# Altium project Flash_Card_Reader.PrjPcb
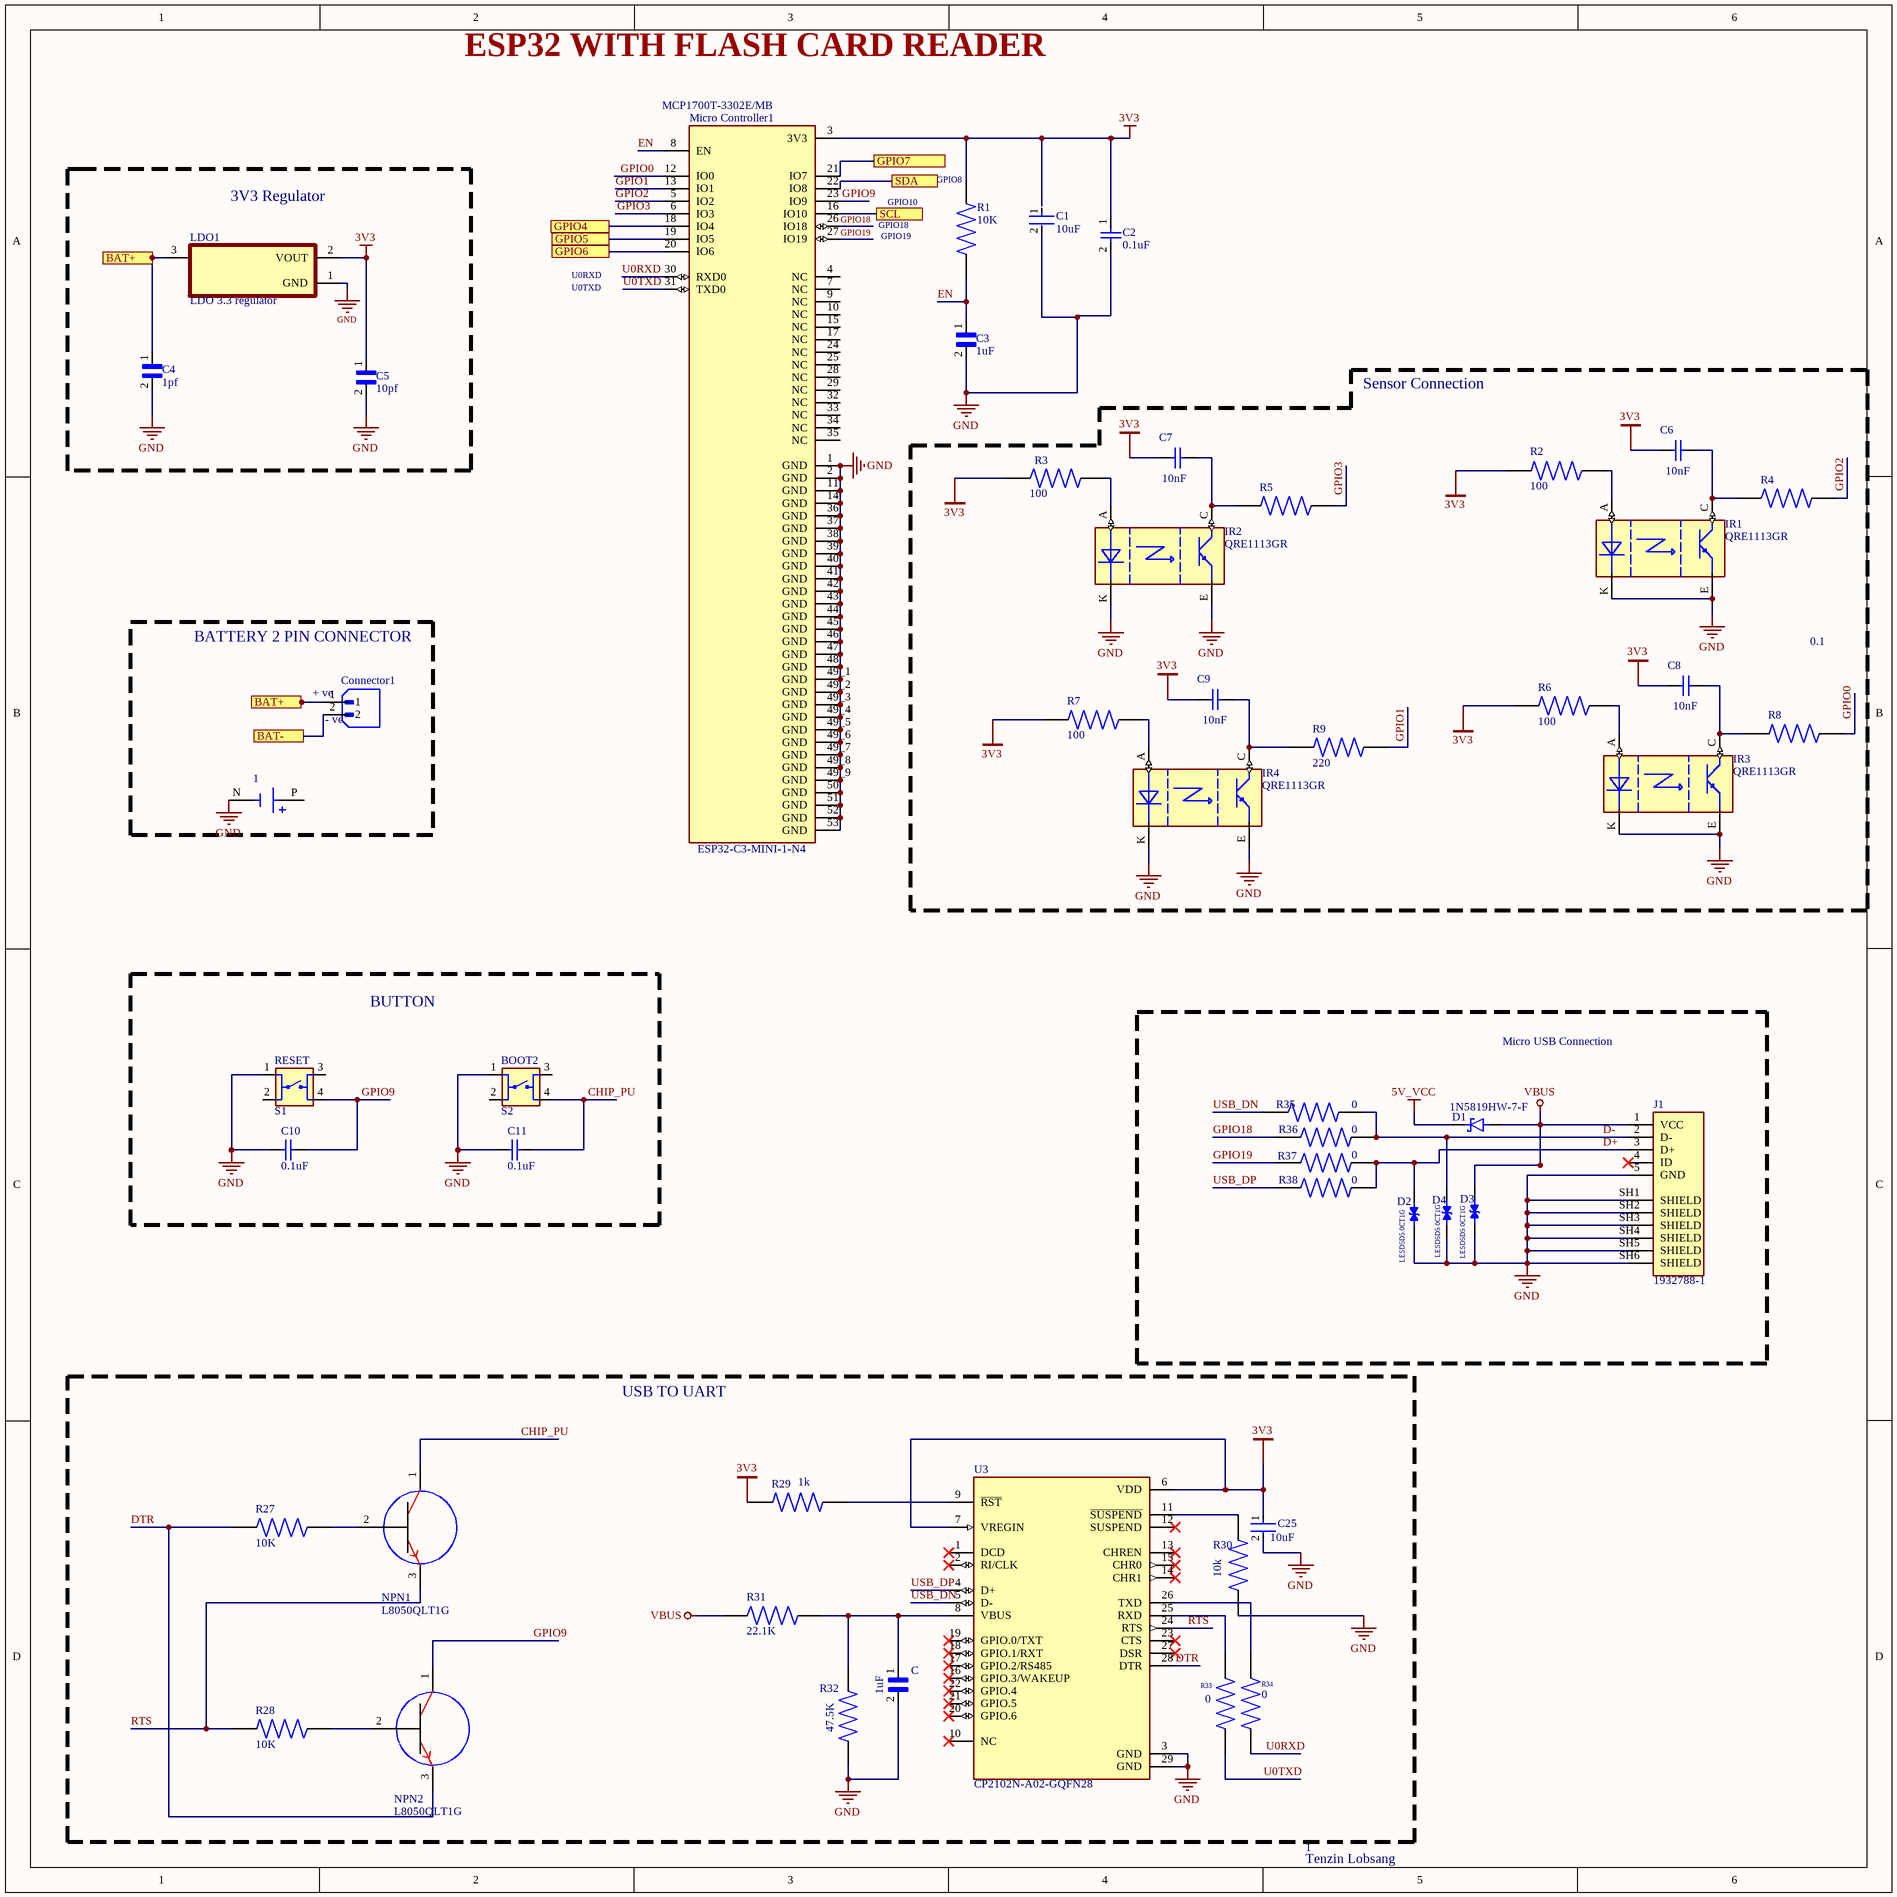
[diagram p0: ESP32_FLASH_CARD_READER.SchDoc]
2 sheets, 98 parts. Net scope: flat (ports and power ports of the same name join across sheets).
Board file: ESP32_FLAS_CARD_READER.PcbDoc
Sheets:
  ESP32_FLASH_CARD_READER.SchDoc
  ESP32_USBC_CHARGER.SchDoc

## Sheet ESP32_FLASH_CARD_READER.SchDoc
size 381 x 381 mm; SheetNumber: 1; SheetTotal: 2

### Parts
1  (no value)  [BAT_1043]
BOOT2  S2  [SW_4-1437565-2]
C  1uF  [CAPC1608X90N]
C1  10uF  [CAPC2012X88N]
C2  0.1uF  [CAPC1608X90X35NL10T15]
C3  1uF  [CAPC1608X90N]
C4  1pf  [CAPC2012X88N]
C5  10pf  [CAPC2012X88N]
C6  10nF  [WCAP-CSGP_0805_L2W1.25H1.25]
C7  10nF  [WCAP-CSGP_0805_L2W1.25H1.25]
C8  10nF  [WCAP-CSGP_0805_L2W1.25H1.25]
C9  10nF  [WCAP-CSGP_0805_L2W1.25H1.25]
C10  0.1uF  [CAPC1608X90X35NL10T15]
C11  0.1uF  [CAPC1608X90X35NL10T15]
C25  10uF  [CAPC2012X88N]
Connector1  B2B-XH-A  [JST_B2B-XH-A]  (value not drawn)
D1  1N5819HW-7-F  [SOD3715X145N]
D2  LESD5D5.0CT1G  [TVS_LESD5D5.0CT1G]
D3  LESD5D5.0CT1G  [TVS_LESD5D5.0CT1G]
D4  LESD5D5.0CT1G  [TVS_LESD5D5.0CT1G]
IR1  QRE1113GR  [4LEADSMD]
IR2  QRE1113GR  [4LEADSMD]
IR3  QRE1113GR  [4LEADSMD]
IR4  QRE1113GR  [4LEADSMD]
J1  1932788-1  [TE_1932788-1]
LDO1  LDO 3.3 regulator  [SOT95P237X112-3N]
Micro_Controller1  ESP32-C3-MINI-1-N4  Supplier Part Number 1: MCP1700T-3302E/MB  [XCVR_ESP32-C3-MINI-1-N4]
NPN1  L8050QLT1G  [SOT-23]
NPN2  L8050QLT1G  [SOT-23]
R1  10K  [RESC1005X40N]
R2  100  [RESC6432X75N]
R3  100  [RESC6432X75N]
R4  220  [RESC1005X35N]  (value not drawn)
R5  220  [RESC1005X35N]  (value not drawn)
R6  100  [RESC6432X75N]
R7  100  [RESC6432X75N]
R8  220  [RESC1005X35N]  (value not drawn)
R9  220  [RESC1005X35N]
R27  10K  [RESC1005X40N]
R28  10K  [RESC1005X40N]
R29  1k  [RES_ERJU06F1001V]
R30  10k  [RESC1005X40N]
R31  22.1K  [RES_ERJS02F2212X]
R32  47.5K  [RES_ERJU06F4752V]
R33  0  [RESC1608X55N]
R34  0  [RESC1608X55N]
R35  0  [RESC1608X55N]
R36  0  [RESC1608X55N]
R37  0  [RESC1608X55N]
R38  0  [RESC1608X55N]
RESET  S1  [SW_4-1437565-2]
U3  CP2102N-A02-GQFN28  [QFN50P500X500X80-29N]

### Blocks framed on the sheet
3V3 Regulator: C4 C5 LDO1
Sensor Connection: C6-C9 IR1-IR4 R2-R9
BATTERY 2 PIN CONNECTOR: 1 Connector1
BUTTON: BOOT2 C10 C11 RESET
Micro USB Connection: D1-D4 J1 R35-R38
USB TO UART: C C25 NPN1 NPN2 R27-R34 U3

### Ports
BAT+, BAT-, GPIO4, GPIO5, GPIO6, GPIO7, SCL, SDA

### Nets
3V3: C2.1 C5.1 C6.1 C7.1 C8.1 C9.1 C25.1 LDO1.2(VOUT) Micro_Controller1.3(3V3) R1.2 R2.1 R3.1 R6.1 R7.1 R29.1 U3.6(VDD) U3.7(VREGIN)
5V_VCC: D1.C(K)
GND: 1.N(NEG) BOOT2.1 C.2 C1.2 C2.2 C3.2 C4.2 C5.2 C10.1 C11.1 C25.2 D2.1 D3.2 D4.1 IR1.E IR1.K IR2.E IR2.K IR3.E IR3.K IR4.E IR4.K J1.5(GND) J1.SH1(SHIELD) J1.SH2(SHIELD) J1.SH3(SHIELD) J1.SH4(SHIELD) J1.SH5(SHIELD) J1.SH6(SHIELD) LDO1.1(GND) Micro_Controller1.1(GND) Micro_Controller1.2(GND) Micro_Controller1.11(GND) Micro_Controller1.14(GND) Micro_Controller1.36(GND) Micro_Controller1.37(GND) Micro_Controller1.38(GND) Micro_Controller1.39(GND) Micro_Controller1.40(GND) Micro_Controller1.41(GND) Micro_Controller1.42(GND) Micro_Controller1.43(GND) Micro_Controller1.44(GND) Micro_Controller1.45(GND) Micro_Controller1.46(GND) Micro_Controller1.47(GND) Micro_Controller1.48(GND) Micro_Controller1.49_1(GND) Micro_Controller1.49_2(GND) Micro_Controller1.49_3(GND) Micro_Controller1.49_4(GND) Micro_Controller1.49_5(GND) Micro_Controller1.49_6(GND) Micro_Controller1.49_7(GND) Micro_Controller1.49_8(GND) Micro_Controller1.49_9(GND) Micro_Controller1.50(GND) Micro_Controller1.51(GND) Micro_Controller1.52(GND) Micro_Controller1.53(GND) R30.1 R32.1 RESET.1 U3.3(GND) U3.29(GND)
VBUS: D1.A D3.1 J1.1(VCC) R31.1
CHIP_PU: BOOT2.4 C11.2 NPN1.1
D+: D2.2 J1.3(D+) R37.1 R38.1
D-: D4.2 J1.2(D-) R35.1 R36.1
DTR: R27.1 U3.28(DTR)
EN: C3.1 Micro_Controller1.8(EN) R1.1
GPIO0: Micro_Controller1.12(IO0) R8.2
GPIO1: Micro_Controller1.13(IO1) R9.2
GPIO2: Micro_Controller1.5(IO2) R4.2
GPIO3: Micro_Controller1.6(IO3) R5.2
GPIO9: C10.2 Micro_Controller1.23(IO9) NPN2.1 RESET.4
GPIO18: Micro_Controller1.26(IO18) R36.2
GPIO19: Micro_Controller1.27(IO19) R37.2
RTS: R28.1 U3.24(RTS)
U0RXD: Micro_Controller1.30(RXD0) R34.1
U0TXD: Micro_Controller1.31(TXD0) R33.1
USB_DN: R35.2 U3.5(D-)
USB_DP: R38.2 U3.4(D+)
NetC4_1: C4.1 Connector1.1 LDO1.3(VIN) ; port BAT+
NetC6_2: C6.2 IR1.C R4.1
NetC7_2: C7.2 IR2.C R5.1
NetC8_2: C8.2 IR3.C R8.1
NetC9_2: C9.2 IR4.C R9.1
NetC21_2: Connector1.2 ; port BAT-
NetC_1: C.1 R31.2 R32.2 U3.8(VBUS)
NetDAC1_4: Micro_Controller1.22(IO8) ; port SDA
NetDAC1_5: Micro_Controller1.16(IO10) ; port SCL
NetIR1_A: IR1.A R2.2
NetIR2_A: IR2.A R3.2
NetIR3_A: IR3.A R6.2
NetIR4_A: IR4.A R7.2
NetMicro_Controller1_18: Micro_Controller1.18(IO4) ; port GPIO4
NetMicro_Controller1_19: Micro_Controller1.19(IO5) ; port GPIO5
NetMicro_Controller1_20: Micro_Controller1.20(IO6) ; port GPIO6
NetMicro_Controller1_21: Micro_Controller1.21(IO7) ; port GPIO7
NetNPN1_2: NPN1.2 R27.2
NetNPN2_2: NPN2.2 R28.2
NetR29_2: R29.2 U3.9(~{RST})
NetR30_2: R30.2 U3.11(~{SUSPEND})
NetR33_2: R33.2 U3.25(RXD)
NetR34_2: R34.2 U3.26(TXD)

Not connected (* = marked no-connect by the designer): 1 P(POS); BOOT2 2 3; C1 1; J1 4(ID)*; Micro_Controller1 4(NC) 7(NC) 9(NC) 10(NC) 15(NC) 17(NC) 24(NC) 25(NC) 28(NC) 29(NC) 32(NC) 33(NC) 34(NC) 35(NC); NPN1 3; NPN2 3; RESET 2 3; U3 1(DCD)* 2(RI/CLK)* 10(NC)* 12(SUSPEND)* 13(CHREN)* 14(CHR1)* 15(CHR0)* 16(GPIO.3/WAKEUP)* 17(GPIO.2/RS485)* 18(GPIO.1/RXT)* 19(GPIO.0/TXT)* 20(GPIO.6)* 21(GPIO.5)* 22(GPIO.4)* 23(CTS)* 27(DSR)*

### Notes on the sheet
- ESP32 WITH FLASH CARD READER
- GPIO10
- (near R1) GPIO8
- U0RXD
- GPIO18
- GPIO19
- U0TXD
- 0.1
- (near Connector1) + ve
- (near Connector1) - ve
- 1
- Tenzin Lobsang

### Library data of the parts
1 = 1043: Price: None; Availability: Unavailable; Value: *; MP: 1043; Package: None
BOOT2 RESET = 4-1437565-2: Switch Tactile OFF (ON) SPST Round Button Gull Wing 0.05A 12VDC 1.57N SMD T/R; Availability: Unavailable; Package: None; MP: 4-1437565-2; Value: *; Price: None
C C3 = CL10B105KO8NNNC: 1ÂµF Â±10% 16V Ceramic Capacitor X7R 0603 (1608 Metric); MF: Samsung Electro-Mechanics; Digi-Key_Part_Number: 1276-1019-1-ND; Arrow_Electronics-Purchase-URL: https://snapeda.com/shop?store=Arrow+Electronics&id=3597999; Package: 0603 Samsung; DigiKey-Purchase-URL: https://snapeda.com/shop?store=DigiKey&id=3597999; SnapEDA_Link: https://www.snapeda.com/parts/CL10B105KO8NNNC/Samsung%20Electro-Mechanics/view-part/3597999/?ref=snap; MP: CL10B105KO8NNNC; Value: *
  C3: BuyPart: https://www.snapeda.com/parts/CL10B105KO8NNNC/Samsung%20Electro-Mechanics/view-part/3597999/?ref=eda
C1 C25 = CMP-13271-004224-1: Cap Ceramic 10uF 25V X5R ±20% Pad SMD 0603 +85°C T/R; Width: 0.031inch; Voltage Rating: 25V; Length: 0.063inch; Case Code (Metric): 1608; Dielectric: X5R; Termination: Wraparound; Capacitance: 10uF; Lead Free: Lead Free; Mount: Surface Mount; Package Quantity: 1; Case Code (Imperial): 0603; Thickness: 0.035inch; Packaging: Tape and Reel; Contact Plating: Tin; Min Operating Temperature: -55°C; Tolerance: 20%; Max Operating Temperature: 85°C; Case/Package: 0603
C2 C10 C11 = CMP-2100-03643-1: Chip Capacitor, 0.1 uF, +/- 10%, 50 V, -55 to 125 degC, 0603 (1608 Metric), RoHS, Tape and Reel; Manufacturer: Murata; Dielectric Material: Ceramic; Voltage Rating: 50V; Capacitance: 100nF; Dielectric: X7R; Insulation Resistance: 10GR; Case Code (Metric): 1608; Lead Free: LeadFree; Depth: 0.8mm; Number of Pins: 2; Radiation Hardening: No; Case/Package: 0603; Manufacturer URL: http://www.murata.com/; Packaging: TapeandReel; Length: 1.6mm; Contact Plating: Tin; Datasheet URL: http://psearch.en.murata.com/capacitor/product/GRM188R71H104KA93%23.pdf; Tolerance: 10%; Case Code (Imperial): 0603; Min Operating Temperature: -55degC; RoHSCompliant: true; Voltage: 50V; Termination: SMD/SMT; Mount: SurfaceMount; Material: Ceramic; Package Quantity: 1; Height: 0.8mm; Thickness: 0.035inch; REACH SVHC: NoSVHC; Max Operating Temperature: 125degC; Width: 0.8mm; Package Reference: 0603; Voltage Rating (DC): 50V; Datasheet Version: 42675.0; Package Description: 2-Pin Surface Mount Device, Body 1.6 x 0.8 mm
C4 C5 = C0805C100K5RAC7800: Package: None; Price: None; Value: *; MP: C0805C100K5RAC7800; Availability: Unavailable
C6-C9 = 885012007009: WCAP-CSGP Multilayer Ceramic Chip Capacitor, General Purpose, size 0805, NP0, 10nF, 10V; Manufacturer: Wurth Elektronik; Case/Size Code: 0805; Capacitance Tolerance: +/-5%; Insulation Resistance: 10GΩ; Q Factor: 1000; Technical Reference: NP00805103J010DFCT10000; Manufacturer Part Number: 885012007009; Category: Multilayer Ceramic Chip Capacitors; Match Code: WCAP-CSGP; ComponentLink1Description: Website Link; ComponentLink1URL: https://www.we-online.com/redexpert/article/885012007009?ad; ComponentLink2Description: Datasheet Link; ComponentLink2URL: https://www.we-online.com/redexpert/spec/885012007009?ad; Mount: Surface Mount; Min Operating Temperature: -55°C; Max Operating Temperature: 125°C; Packaging: Tape and Reel; Length: 2mm; Width: 1.25mm; Height: 1.25mm; Capacitance: 10nF; Ceramic Type: NP0; Rated Voltage (DC): 10V
Connector1 = B2B-XH-A: MF: {'manufacturer': u'JST Sales America Inc.'}; Package: None; Price: None; Value: *; MP: B2B-XH-A; Availability: Unavailable
D1 = 1N5819HW-7-F: Diode Schottky 40 V 1A Surface Mount SOD-123; MF: Diodes Inc.; Value: *; SnapEDA_Link: https://www.snapeda.com/parts/1N5819HW-7-F/Diodes+Inc./view-part/?ref=snap; Purchase-URL: https://pricing.snapeda.com/search/part/1N5819HW-7-F/?ref=eda; Availability: In Stock; Price: None; Package: SOD-123 Fairchild Semiconductor; Check_prices: https://www.snapeda.com/parts/1N5819HW-7-F/Diodes+Inc./view-part/?ref=eda; MP: 1N5819HW-7-F
D2-D4 = LESD5D5.0CT1G: Transient Voltage Suppressors for ESD Protection; MF: Leshan Radio Co.; Check_prices: https://www.snapeda.com/parts/LESD5D5.0CT1G/Leshan+Radio+Co./view-part/?ref=eda; Value: *; Availability: Not in stock; Package: None; SnapEDA_Link: https://www.snapeda.com/parts/LESD5D5.0CT1G/Leshan+Radio+Co./view-part/?ref=snap; MP: LESD5D5.0CT1G; Price: None
IR1-IR4 = QRE1113GR: Optical Switches, Reflective, Phototransistor Output Reflective Sensor; MF: SparkFun; SnapEDA_Link: https://www.snapeda.com/parts/QRE1113/SparkFun/view-part/?ref=snap; Package: None; Value: *; MP: QRE1113; Check_prices: https://www.snapeda.com/parts/QRE1113/SparkFun/view-part/?ref=eda
LDO1 = MCP1700T-3002E/TT: 25V 10uF X5R ±20% 0603 Multilayer Ceramic Capacitors MLCC - SMD/SMT ROHS; Manufacturer: Samsung; Manufacturer Part Number: CL10A106MA8NRNC; MF: Microchip; SnapEDA_Link: https://www.snapeda.com/parts/MCP1700T-3002E/TT/Microchip/view-part/48518/?ref=snap; MP: MCP1700T-3002E/TT; Availability: Unavailable; Price: None; Value: *; Package: SOT-23 Microchip; Supplier 1: Avnet; RoHS: Yes; Category: Ceramic Capacitors; Stock 1: 9192000; Pricing 1: 4000=0.01575 (USD); Mount: Surface Mount; Case/Package: 0603; Case Code (Metric): 1608; Case Code (Imperial): 0603; Material: Ceramic; Min Operating Temperature: -55°C; Max Operating Temperature: 85°C; Packaging: Cut Tape; Capacitance: 10uF; Tolerance: 20%; Voltage Rating: 25V; Series: CL; Height: 900um; Lead Free: Lead Free; RoHS Compliant: Yes; ComponentLink1URL: https://datasheet.ciiva.com/25766/cl10a106ma8nrnc-25766562.pdf?src-supplier=Digikey; ComponentLink1Description: https://datasheet.ciiva.com/25766/cl10a106ma8nrnc-25766562.pdf?src-supplier=Digikey
Micro_Controller1 = ESP32-C3-MINI-1-N4: Pwr Sply Func, Voltage Regulator, LDO, SOT-89, PD 1.635W, VO 3.3V, Regline +/-0.75%/V; Manufacturer: Microchip; MF: Espressif Systems; Number of Outputs: 1; Min Input Voltage: 2.3V; Max Output Current: 250mA; Dropout Voltage: 178mV; Max Input Voltage: 6V; Input Bias Current: 1.6uA; Polarity: Positive; Quiescent Current: 4uA; Accuracy: 3%; Output Type: Fixed; Output Voltage Accuracy: 2%; SnapEDA_Link: https://www.snapeda.com/parts/ESP32-C3-MINI-1-N4/Espressif+Systems/view-part/?ref=snap; Package: SMD-53 Espressif Systems; Value: *; MP: ESP32-C3-MINI-1-N4; Check_prices: https://www.snapeda.com/parts/ESP32-C3-MINI-1-N4/Espressif+Systems/view-part/?ref=eda; Supplier 1: Arrow Electronics; Manufacturer Part Number: MCP1700T-3302E/MB; RoHS: Yes; Category: Voltage Regulators - Linear; Stock 1: 650; Pricing 1: 1=0.4806, 10=0.4731, 25=0.4655, 100=0.458, 250=0.4505, 500=0.4429 (USD); Mount: Surface Mount; Case/Package: SOT-89; Number of Pins: 3; Min Operating Temperature: -40°C; Max Operating Temperature: 125°C; Packaging: Tape and Reel; Output Voltage: 3.3V; Output Current: 250mA; Nominal Output Voltage: 3.3V; Package Quantity: 1000; Max Power Dissipation: 1.635W; Min Output Voltage: 3.3V; Power Dissipation: 1.635W; Max Supply Voltage: 6V; Min Supply Voltage: 2.3V; Max Output Voltage: 3.3V; Termination: SMD/SMT; Supply Current: 4uA; Number of Channels: 1; Length: 4.6mm; Width: 2.29mm; Height: 1.6mm; Radiation Hardening: No; Reach SVHC Compliant: No; Lead Free: Lead Free; RoHS Compliant: Yes
R1 R27 R28 R30 = CRG0402J10K/10: CRG0402 chip resistor,10K 5% 0.063W | TE Connectivity CRG0402J10K/10; Power_Rating: .063 W; Voltage_Rating: 50 V; SnapEDA_Link: https://www.snapeda.com/parts/CRG0402J10K/10/TE+Connectivity+Passive+Product/view-part/?ref=snap; Package: 0402; Resistance: 10K; Value: *; MF: TE Connectivity; MP: CRG0402J10K/10; EU_RoHS_Compliance: Compliant with Exemptions; Tolerance: 5%; Check_prices: https://www.snapeda.com/parts/CRG0402J10K/10/TE+Connectivity+Passive+Product/view-part/?ref=eda
R2 R3 R6 R7 = CRS2512-FX-1000ELF: CRS Series Anti-surge Resistor 2512 Case 100Ohms 2W +/-100ppm/degC | Bourns CRS2512-FX-1000ELF; SnapEDA_Link: https://www.snapeda.com/parts/CRS2512-FX-1000ELF/Bourns/view-part/?ref=snap; Package: 6432 Bourns; Value: *; MF: Bourns; MP: CRS2512-FX-1000ELF; Check_prices: https://www.snapeda.com/parts/CRS2512-FX-1000ELF/Bourns/view-part/?ref=eda
R4 R5 R8 R9 = CPF0402B220RE1: Resistencia de pelÃ­cula delgada de precisiÃ³n SMD, carcasa 0402, 220 ohmios +/-0,1 %, 063 W +/-25 ppm/C ¦ TE Connectivity CPF0402B220RE1; Power_Rating: .063 W; Voltage_Rating: 25 V; Tolerance: .1%; SnapEDA_Link: https://www.snapeda.com/parts/CPF0402B220RE1/TE+Connectivity/view-part/?ref=snap; Package: 0402; Resistance: 220; Value: *; MF: TE Connectivity; MP: CPF0402B220RE1; EU_RoHS_Compliance: Compliant; Check_prices: https://www.snapeda.com/parts/CPF0402B220RE1/TE+Connectivity/view-part/?ref=eda
R29 = ERJU06F1001V: Res Thick Film 0805 1K Ohm 1% 0.125W(1/8W) Â±100ppm/C Sulfur Resistant Pad SMD Automotive T/R; MF: Panasonic; Availability: No availability data; Value: *; Check_prices: https://www.snapeda.com/parts/ERJU06F1001V/Panasonic/view-part/5742057/?ref=eda; Package: 2012-2 Panasonic; SnapEDA_Link: https://www.snapeda.com/parts/ERJU06F1001V/Panasonic/view-part/5742057/?ref=snap; Price: None; MP: ERJU06F1001V
R31 = ERJS02F2212X: Price: None; MP: ERJS02F2212X; Package: None; Value: *; Availability: Unavailable
R32 = ERJU06F4752V: Package: None; Price: None; MP: ERJU06F4752V; Availability: Unavailable; Value: *
R33-R38 = MC0603SAF0000T5E: Package: None; Value: *; Price: None; MP: MC0603SAF0000T5E; Availability: Unavailable
U3 = CP2102N-A02-GQFN28: USB Bridge, USB to UART USB 2.0 UART Interface 28-QFN (5x5); MF: Silicon Labs; Value: *; Price: None; Package: WFQFN-28 Silicon Labs; Check_prices: https://www.snapeda.com/parts/CP2102N-A02-GQFN28/Silicon+Labs/view-part/?ref=eda; Availability: In Stock; SnapEDA_Link: https://www.snapeda.com/parts/CP2102N-A02-GQFN28/Silicon+Labs/view-part/?ref=snap; Purchase-URL: https://pricing.snapeda.com/search/part/CP2102N-A02-GQFN28/?ref=eda; MP: CP2102N-A02-GQFN28
J1 = 1932788-1: Package: None; Price: None; Value: *; MP: 1932788-1; Availability: Unavailable

## Sheet ESP32_USBC_CHARGER.SchDoc
size B; SheetNumber: 2; SheetTotal: 2
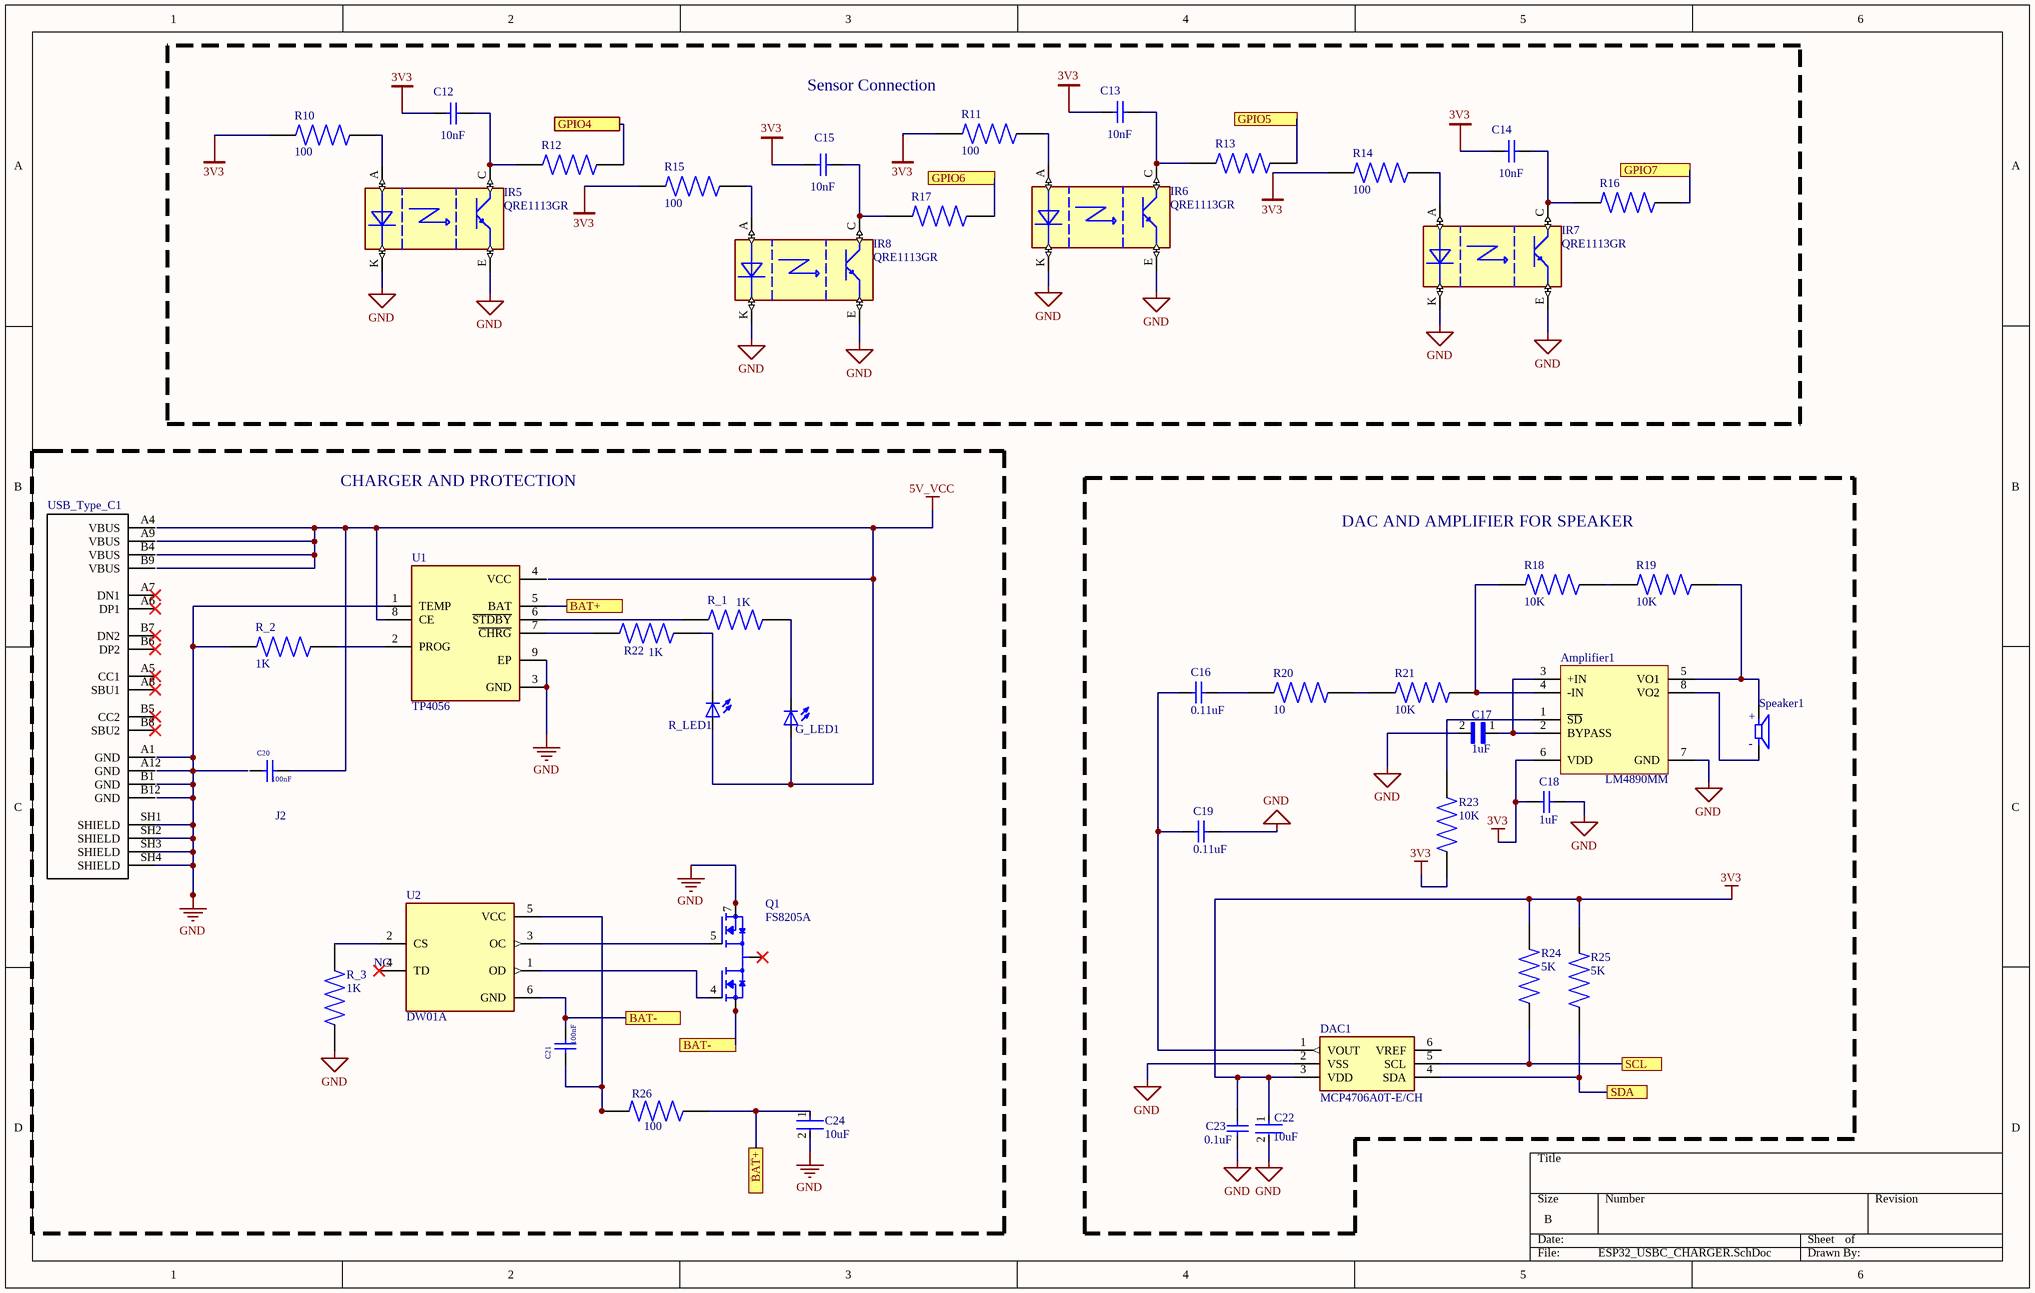
[diagram p1: ESP32_USBC_CHARGER.SchDoc]

### Parts
Amplifier1  LM4890MM  [DGK0008A_M]
C12  10nF  [WCAP-CSGP_0805_L2W1.25H1.25]
C13  10nF  [WCAP-CSGP_0805_L2W1.25H1.25]
C14  10nF  [WCAP-CSGP_0805_L2W1.25H1.25]
C15  10nF  [WCAP-CSGP_0805_L2W1.25H1.25]
C16  0.11uF  [CAPC1608X90X35NL10T15]
C17  1uF  [CAPC1608X90N]
C18  1uF  [CAPC1608X90X35NL10T15]
C19  0.11uF  [CAPC1608X90X35NL10T15]
C20  100nF  [WCAP-CSGP_0402_L1W0.5H0.5]
C21  100nF  [WCAP-CSGP_0402_L1W0.5H0.5]
C22  10uF  [CAPC2012X88N]
C23  0.1uF  [CAPC1608X90X35NL10T15]
C24  10uF  [CAPC2012X88N]
DAC1  MCP4706A0T-E/CH  [SOT95P270X145-6N]
G_LED1  TLLR4400  [LED3MM]  (value not drawn)
IR5  QRE1113GR  [4LEADSMD]
IR6  QRE1113GR  [4LEADSMD]
IR7  QRE1113GR  [4LEADSMD]
IR8  QRE1113GR  [4LEADSMD]
Q1  FS8205A  [SOP65P640X120-8N]
R10  100  [RESC6432X75N]
R11  100  [RESC6432X75N]
R12  220  [RESC1005X35N]  (value not drawn)
R13  220  [RESC1005X35N]  (value not drawn)
R14  100  [RESC6432X75N]
R15  100  [RESC6432X75N]
R16  220  [RESC1005X35N]  (value not drawn)
R17  220  [RESC1005X35N]  (value not drawn)
R18  10K  [RESC1005X40N]
R19  10K  [RESC1005X40N]
R20  10  [RESC1005X40N]
R21  10K  [RESC1005X40N]
R22  1K  [RES_ERJU06F1001V]
R23  10K  [RESC1005X40N]
R24  5K  [RESC3126X65N]
R25  5K  [RESC3126X65N]
R26  100  [RESC6432X75N]
R_1  1K  [RES_ERJU06F1001V]
R_2  1K  [RES_ERJU06F1001V]
R_3  1K  [RES_ERJU06F1001V]
R_LED1  TLLR4400  [LED3MM]  (value not drawn)
Speaker1  CVS-1508  [SPKR_CVS-1508]  (value not drawn)
U1  TP4056  [SOP127P600X175-9N]
U2  DW01A  [SOT95P280X145-6N]
USB_Type_C1  UJ20-C-H-G-SMT-TR  [*CUI_UJ20-C-H-G-SMT-TR_UJ20-C-H-G-SMT-TR(Primary)]  (value not drawn)

### Blocks framed on the sheet
Sensor Connection: C12-C15 IR5-IR8 R10-R17
CHARGER AND PROTECTION: C20 C21 C24 G_LED1 Q1 R22 R26 R_1-R_3 R_LED1 U1 U2 USB_Type_C1
DAC AND AMPLIFIER FOR SPEAKER: Amplifier1 C16-C19 C22 C23 DAC1 R18-R21 R23-R25 Speaker1

### Ports
BAT+, BAT-, GPIO4, GPIO5, GPIO6, GPIO7, SCL, SDA

### Nets
3V3: Amplifier1.6(VDD) C12.1 C13.1 C14.1 C15.1 C18.1 C22.1 C23.2 DAC1.3(VDD) R10.1 R11.1 R14.1 R15.1 R23.1 R24.2 R25.2
5V_VCC: C20.2 G_LED1.A R_LED1.A U1.8(CE)
GND: Amplifier1.7(GND) C17.2 C18.2 C19.2 C22.2 C23.1 C24.2 DAC1.2(VSS) IR5.E IR5.K IR6.E IR6.K IR7.E IR7.K IR8.E IR8.K Q1.6(S2) Q1.7(S2) R_2.1 R_3.1 U1.1(TEMP) U1.3(GND) U1.9(EP) USB_Type_C1.SH1(SHIELD) USB_Type_C1.SH2(SHIELD) USB_Type_C1.SH3(SHIELD) USB_Type_C1.SH4(SHIELD)
NetAmplifier1_1: Amplifier1.1(~{SD}) R23.2
NetAmplifier1_2: Amplifier1.2(BYPASS) Amplifier1.3(+IN) C17.1
NetAmplifier1_4: Amplifier1.4(-IN) R18.1 R21.2
NetAmplifier1_5: Amplifier1.5(VO1) R19.2 Speaker1.P
NetAmplifier1_8: Amplifier1.8(VO2) Speaker1.M
NetC4_1: C24.1 R26.2 U1.5(BAT) ; port BAT+
NetC12_2: C12.2 IR5.C R12.1
NetC13_2: C13.2 IR6.C R13.1
NetC14_2: C14.2 IR7.C R16.1
NetC15_2: C15.2 IR8.C R17.1
NetC16_1: C16.1 C19.1 DAC1.1(VOUT)
NetC16_2: C16.2 R20.1
NetC21_1: C21.1 R26.1 U2.5(VCC)
NetC21_2: C21.2 Q1.2(S1) Q1.3(S1) U2.6(GND) ; port BAT-
NetDAC1_4: DAC1.4(SDA) R25.1 ; port SDA
NetDAC1_5: DAC1.5(SCL) R24.1 ; port SCL
NetG_LED1_K: G_LED1.K(C) R_1.2
NetIR5_A: IR5.A R10.2
NetIR6_A: IR6.A R11.2
NetIR7_A: IR7.A R14.2
NetIR8_A: IR8.A R15.2
NetMicro_Controller1_18: R12.2 ; port GPIO4
NetMicro_Controller1_19: R13.2 ; port GPIO5
NetMicro_Controller1_20: R17.2 ; port GPIO6
NetMicro_Controller1_21: R16.2 ; port GPIO7
NetQ1_1: Q1.1(D12) Q1.8(D12)
NetQ1_4: Q1.4(G1) U2.1(OD)
NetQ1_5: Q1.5(G2) U2.3(OC)
NetR18_2: R18.2 R19.1
NetR20_2: R20.2 R21.1
NetR22_1: R22.1 U1.7(~{CHRG})
NetR22_2: R22.2 R_LED1.K(C)
NetR_1_1: R_1.1 U1.6(~{STDBY})
NetR_2_2: R_2.2 U1.2(PROG)
NetR_3_2: R_3.2 U2.2(CS)

Not connected (* = marked no-connect by the designer): C20 1; DAC1 6(VREF); U1 4(VCC); U2 4(TD)*; USB_Type_C1 A1(GND) A4(VBUS) A5(CC1)* A6(DP1)* A7(DN1)* A8(SBU1)* A9(VBUS) A12(GND) B1(GND) B4(VBUS) B5(CC2)* B6(DP2)* B7(DN2)* B8(SBU2)* B9(VBUS) B12(GND)

### Notes on the sheet
- (near C20) J2
- (near U2) NC
- (in symbol CVS-1508) +; -

### Library data of the parts
Amplifier1 = CMP-0057-00556-3: 1W Audio Power Amplifier, 8-pin Mini SOIC; Manufacturer: Texas Instruments; PackageTopMarking: ZXTT*G90; CompType: Audio IC; PowerWise: N; ComponentLink1URL: http://www.ti.com/general/docs/lit/getliterature.tsp?genericPartNumber=LM4890&fileType=pdf; ComponentLink1Description: Datasheet URL; RoHS: N; PackageReference: DGK0008A; PackageDescription: MINI SOIC, .118 x .118 x .034in, 8 Lead, .0256in Pitch; PinCount: 8; Code_JEDEC: MO-187-AA
C12-C15 = 885012007009: as C6 on sheet ESP32_FLASH_CARD_READER; Manufacturer Part Number: 885012007009; Category: Multilayer Ceramic Chip Capacitors; Match Code: WCAP-CSGP; ComponentLink1Description: Website Link; ComponentLink1URL: https://www.we-online.com/redexpert/article/885012007009?ad; ComponentLink2Description: Datasheet Link; ComponentLink2URL: https://www.we-online.com/redexpert/spec/885012007009?ad; Mount: Surface Mount; Min Operating Temperature: -55°C; Max Operating Temperature: 125°C; Packaging: Tape and Reel; Length: 2mm; Width: 1.25mm; Height: 1.25mm; Capacitance: 10nF; Ceramic Type: NP0; Rated Voltage (DC): 10V
C16 C18 C19 C23 = CMP-2100-03643-1: as C2 on sheet ESP32_FLASH_CARD_READER; Case Code (Metric): 1608; Lead Free: LeadFree; Depth: 0.8mm; Number of Pins: 2; Radiation Hardening: No; Case/Package: 0603; Manufacturer URL: http://www.murata.com/; Packaging: TapeandReel; Length: 1.6mm; Contact Plating: Tin; Datasheet URL: http://psearch.en.murata.com/capacitor/product/GRM188R71H104KA93%23.pdf; Tolerance: 10%; Case Code (Imperial): 0603; Min Operating Temperature: -55degC; RoHSCompliant: true; Voltage: 50V; Termination: SMD/SMT; Mount: SurfaceMount; Material: Ceramic; Package Quantity: 1; Height: 0.8mm; Thickness: 0.035inch; REACH SVHC: NoSVHC; Max Operating Temperature: 125degC; Width: 0.8mm; Package Reference: 0603; Voltage Rating (DC): 50V; Datasheet Version: 42675.0; Package Description: 2-Pin Surface Mount Device, Body 1.6 x 0.8 mm
C17 = CL10B105KO8NNNC: as C on sheet ESP32_FLASH_CARD_READER; Digi-Key_Part_Number: 1276-1019-1-ND; Arrow_Electronics-Purchase-URL: https://snapeda.com/shop?store=Arrow+Electronics&id=3597999; Package: 0603 Samsung; DigiKey-Purchase-URL: https://snapeda.com/shop?store=DigiKey&id=3597999; SnapEDA_Link: https://www.snapeda.com/parts/CL10B105KO8NNNC/Samsung%20Electro-Mechanics/view-part/3597999/?ref=snap; MP: CL10B105KO8NNNC; Value: *
C20 C21 = 885012105001: WCAP-CSGP Multilayer Ceramic Chip Capacitor, General Purpose, size 0402, X5R, 100nF, 6.3V; Manufacturer: Wurth Elektronik; Case/Size Code: 0402; Capacitance Tolerance: +/-20%; Dissipation Factor: 10%; Insulation Resistance: 1GΩ; Technical Reference: X5R0402104M6R3DFCT10000; Manufacturer Part Number: 885012105001; Category: Multilayer Ceramic Chip Capacitors; Match Code: WCAP-CSGP; ComponentLink1Description: Website Link; ComponentLink1URL: https://www.we-online.com/redexpert/article/885012105001?ad; ComponentLink2Description: Datasheet Link; ComponentLink2URL: https://www.we-online.com/redexpert/spec/885012105001?ad; Mount: Surface Mount; Min Operating Temperature: -55°C; Max Operating Temperature: 85°C; Packaging: Tape and Reel; Length: 1mm; Width: 0.5mm; Height: 0.5mm; Capacitance: 100nF; Ceramic Type: X5R; Rated Voltage (DC): 6.3V
C22 C24 = CMP-13271-004224-1: as C1 on sheet ESP32_FLASH_CARD_READER; Width: 0.031inch; Voltage Rating: 25V; Length: 0.063inch; Case Code (Metric): 1608; Dielectric: X5R; Termination: Wraparound; Capacitance: 10uF; Lead Free: Lead Free; Mount: Surface Mount; Package Quantity: 1; Case Code (Imperial): 0603; Thickness: 0.035inch; Packaging: Tape and Reel; Contact Plating: Tin; Min Operating Temperature: -55°C; Tolerance: 20%; Max Operating Temperature: 85°C; Case/Package: 0603
DAC1 = MCP4706A0T-E_CH: IC, OUTPUT D/A CONVERTER;8-BIT W/EEPROM & I2C INTERFACE;-40 TO 125C;SOT23 | Microchip Technology Inc. MCP4706A0T-E/CH; SnapEDA_Link: https://www.snapeda.com/parts/MCP4706A0T-E/CH/Microchip/view-part/?ref=snap; Package: SOT-23-6 Microchip; Value: *; MF: Microchip; MP: MCP4706A0T-E/CH; Check_prices: https://www.snapeda.com/parts/MCP4706A0T-E/CH/Microchip/view-part/?ref=eda
G_LED1 R_LED1 = TLLR4400: Red 619nm LED Indication - Discrete 1.9V Radial; MF: Vishay; SnapEDA_Link: https://www.snapeda.com/parts/TLLR4400/Vishay+Semiconductor+Opto+Division/view-part/?ref=snap; Package: None; Value: *; MP: TLLR4400; Check_prices: https://www.snapeda.com/parts/TLLR4400/Vishay+Semiconductor+Opto+Division/view-part/?ref=eda
IR5-IR8 = QRE1113GR: as IR1 on sheet ESP32_FLASH_CARD_READER; SnapEDA_Link: https://www.snapeda.com/parts/QRE1113/SparkFun/view-part/?ref=snap; Package: None; Value: *; MP: QRE1113; Check_prices: https://www.snapeda.com/parts/QRE1113/SparkFun/view-part/?ref=eda
Q1 = FS8205A: MF: Fortune Semiconductor; SnapEDA_Link: https://www.snapeda.com/parts/FS8205A/Fortune+Semiconductor/view-part/?ref=snap; Package: Package; Value: *; MP: FS8205A; Check_prices: https://www.snapeda.com/parts/FS8205A/Fortune+Semiconductor/view-part/?ref=eda
R10 R11 R14 R15 R26 = CRS2512-FX-1000ELF: as R2 on sheet ESP32_FLASH_CARD_READER; SnapEDA_Link: https://www.snapeda.com/parts/CRS2512-FX-1000ELF/Bourns/view-part/?ref=snap; Package: 6432 Bourns; Value: *; MF: Bourns; MP: CRS2512-FX-1000ELF; Check_prices: https://www.snapeda.com/parts/CRS2512-FX-1000ELF/Bourns/view-part/?ref=eda
R12 R13 R16 R17 = CPF0402B220RE1: as R4 on sheet ESP32_FLASH_CARD_READER; SnapEDA_Link: https://www.snapeda.com/parts/CPF0402B220RE1/TE+Connectivity/view-part/?ref=snap; Package: 0402; Resistance: 220; Value: *; MF: TE Connectivity; MP: CPF0402B220RE1; EU_RoHS_Compliance: Compliant; Check_prices: https://www.snapeda.com/parts/CPF0402B220RE1/TE+Connectivity/view-part/?ref=eda
R18-R21 R23 = CRG0402J10K/10: as R1 on sheet ESP32_FLASH_CARD_READER; SnapEDA_Link: https://www.snapeda.com/parts/CRG0402J10K/10/TE+Connectivity+Passive+Product/view-part/?ref=snap; Package: 0402; Resistance: 10K; Value: *; MF: TE Connectivity; MP: CRG0402J10K/10; EU_RoHS_Compliance: Compliant with Exemptions; Tolerance: 5%; Check_prices: https://www.snapeda.com/parts/CRG0402J10K/10/TE+Connectivity+Passive+Product/view-part/?ref=eda
R22 R_1-R_3 = ERJU06F1001V: as R29 on sheet ESP32_FLASH_CARD_READER; Availability: No availability data; Value: *; Check_prices: https://www.snapeda.com/parts/ERJU06F1001V/Panasonic/view-part/5742057/?ref=eda; Package: 2012-2 Panasonic; SnapEDA_Link: https://www.snapeda.com/parts/ERJU06F1001V/Panasonic/view-part/5742057/?ref=snap; Price: None; MP: ERJU06F1001V
R24 R25 = RL73H2ER33FTD: RL73H 2E R33 1% 5K RL; Power_Rating: .5 W; Resistance: 33; MF: TE Connectivity; SnapEDA_Link: https://www.snapeda.com/parts/RL73H2ER33FTD/TE+Connectivity/view-part/?ref=snap; Package: 1210; Value: *; MP: RL73H2ER33FTD; EU_RoHS_Compliance: Compliant with Exemptions; Tolerance: 1%; Check_prices: https://www.snapeda.com/parts/RL73H2ER33FTD/TE+Connectivity/view-part/?ref=eda
Speaker1 = CVS-1508: 15 mm, Round Frame, 0.3 W, 8 Ohm, Neodymium Magnet, Mylar Cone; MF: CUI Devices; Digi-Key_Part_Number: 102-2498-ND; DigiKey-Purchase-URL: https://snapeda.com/shop?store=DigiKey&id=681641; Package: CUI Inc.; Value: *; SnapEDA_Link: https://www.snapeda.com/parts/CVS-1508/CUI%20Devices/view-part/681641/?ref=snap; MP: CVS-1508; CUI_purchase_URL: https://www.cuidevices.com/product/audio/speakers/miniature-_10-mm~40-mm_/cvs-1508?utm_source=snapeda.com&utm_medium=referral&utm_campaign=snapedaBOM
U1 = TP4056: Complete single cell Li-Ion battery with a constant current / constant voltage linear charger; MF: NanJing Top Power ASIC Corp.; Check_prices: https://www.snapeda.com/parts/TP4056/NanJing+Top+Power+ASIC+Corp./view-part/?ref=eda; SnapEDA_Link: https://www.snapeda.com/parts/TP4056/NanJing+Top+Power+ASIC+Corp./view-part/?ref=snap; Price: None; Availability: Not in stock; Package: Package; MP: TP4056; Value: *
U2 = DW01A: One Cell Lithium-ion/Polymer Battery Protection IC; MF: Fortune Semiconductor; SnapEDA_Link: https://www.snapeda.com/parts/DW01A/Fortune+Semiconductor/view-part/?ref=snap; Package: SOT-23-6 Fortune Semiconductor; Value: *; MP: DW01A; Check_prices: https://www.snapeda.com/parts/DW01A/Fortune+Semiconductor/view-part/?ref=eda
USB_Type_C1 = UJ20-C-H-G-SMT-TR: SnapEDA_Link: https://www.snapeda.com/parts/UJ20-C-H-G-SMT-TR/Same+Sky/view-part/?ref=snap; Check_prices: https://www.snapeda.com/parts/UJ20-C-H-G-SMT-TR/Same+Sky/view-part/?ref=eda; Value: *

## Nets that join several sheets
3V3: ESP32_FLASH_CARD_READER (17 pins), ESP32_USBC_CHARGER (16 pins)
5V_VCC: ESP32_FLASH_CARD_READER (D1.C), ESP32_USBC_CHARGER (C20.2 G_LED1.A R_LED1.A U1.8)
GND: ESP32_FLASH_CARD_READER (65 pins), ESP32_USBC_CHARGER (27 pins)
NetC4_1: ESP32_FLASH_CARD_READER (C4.1 Connector1.1 LDO1.3), ESP32_USBC_CHARGER (C24.1 R26.2 U1.5)
NetC21_2: ESP32_FLASH_CARD_READER (Connector1.2), ESP32_USBC_CHARGER (C21.2 Q1.2 Q1.3 U2.6)
NetDAC1_4: ESP32_FLASH_CARD_READER (Micro_Controller1.22), ESP32_USBC_CHARGER (DAC1.4 R25.1)
NetDAC1_5: ESP32_FLASH_CARD_READER (Micro_Controller1.16), ESP32_USBC_CHARGER (DAC1.5 R24.1)
NetMicro_Controller1_18: ESP32_FLASH_CARD_READER (Micro_Controller1.18), ESP32_USBC_CHARGER (R12.2)
NetMicro_Controller1_19: ESP32_FLASH_CARD_READER (Micro_Controller1.19), ESP32_USBC_CHARGER (R13.2)
NetMicro_Controller1_20: ESP32_FLASH_CARD_READER (Micro_Controller1.20), ESP32_USBC_CHARGER (R17.2)
NetMicro_Controller1_21: ESP32_FLASH_CARD_READER (Micro_Controller1.21), ESP32_USBC_CHARGER (R16.2)